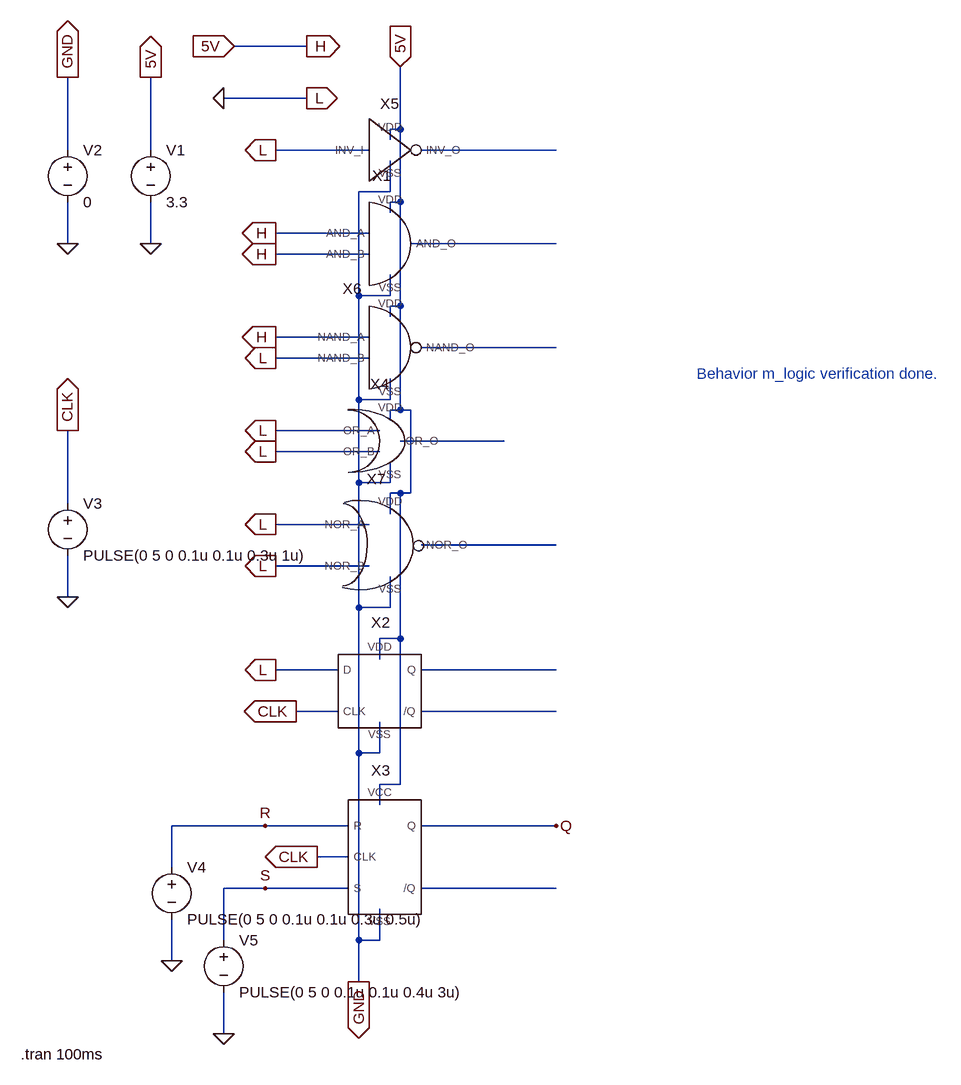
[diagram p0: schematic m_logic_test.asc]
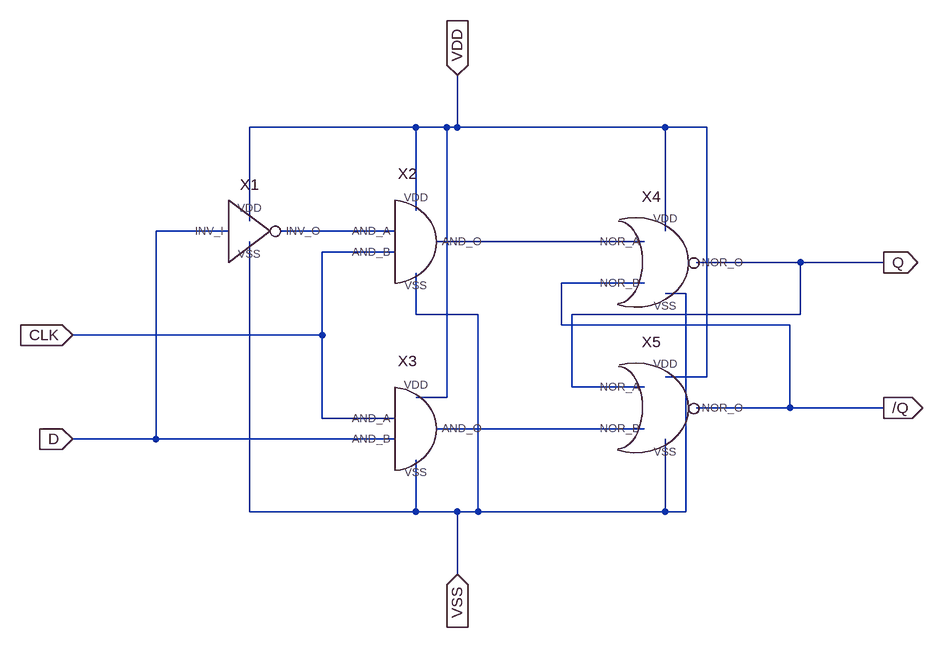
[diagram p1: sub-circuit m_dq_ff.asc]
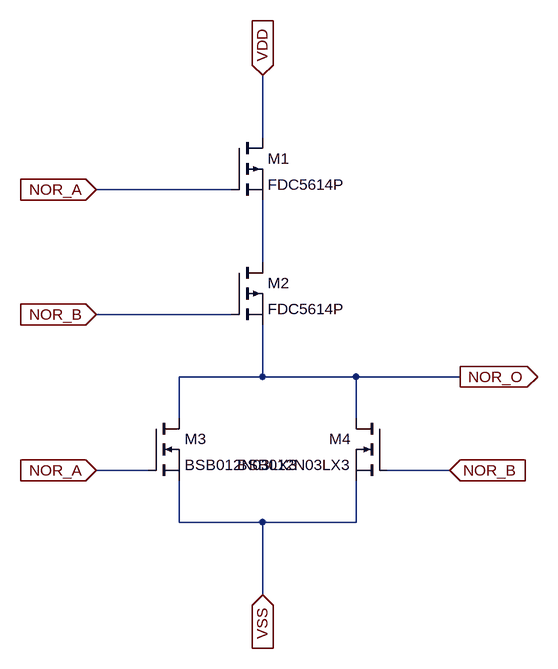
[diagram p2: sub-circuit m_nor.asc]
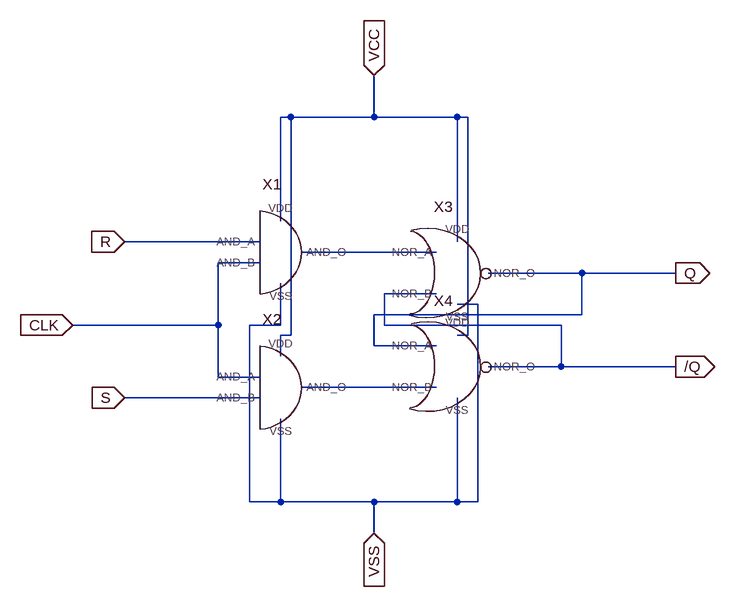
[diagram p3: sub-circuit m_sr_ff.asc]
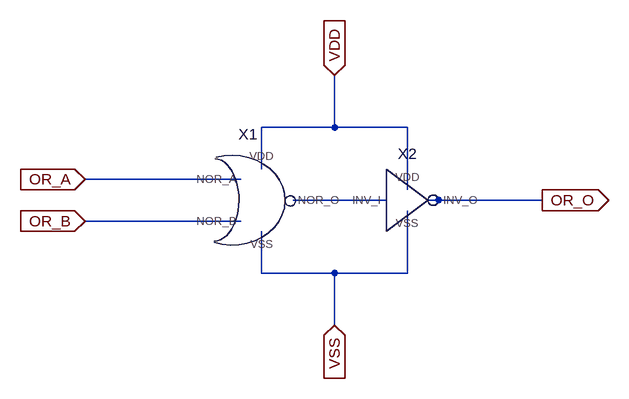
[diagram p4: sub-circuit m_or.asc]
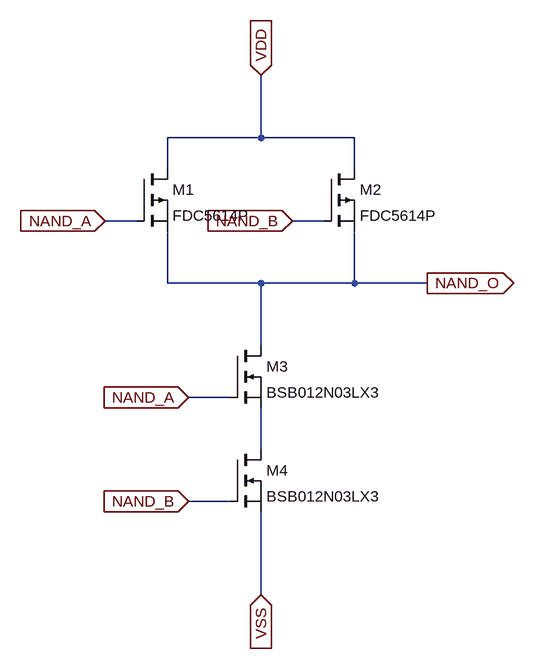
[diagram p5: sub-circuit m_nand.asc]
m_logic_test.asc, the LTspice schematic file:
Version 4
SHEET 1 1028 1140
WIRE 16 -432 -96 -432
WIRE 16 -352 -112 -352
WIRE 160 -304 160 -400
WIRE 160 -304 144 -304
WIRE 144 -288 144 -304
WIRE -352 -272 -352 -384
WIRE -224 -272 -224 -384
WIRE 112 -272 -32 -272
WIRE 400 -272 192 -272
WIRE 144 -208 144 -256
WIRE 144 -208 96 -208
WIRE 160 -192 160 -304
WIRE 160 -192 144 -192
WIRE 144 -176 144 -192
WIRE 112 -144 -32 -144
WIRE -352 -128 -352 -192
WIRE -224 -128 -224 -192
WIRE 400 -128 176 -128
WIRE 112 -112 -32 -112
WIRE 96 -48 96 -208
WIRE 144 -48 144 -80
WIRE 144 -48 96 -48
WIRE 160 -32 160 -192
WIRE 160 -32 144 -32
WIRE 144 -16 144 -32
WIRE 112 16 -32 16
WIRE 400 32 192 32
WIRE 112 48 -32 48
WIRE 96 112 96 -48
WIRE 144 112 144 80
WIRE 144 112 96 112
WIRE 160 128 160 -32
WIRE 160 128 144 128
WIRE 176 128 160 128
WIRE 144 144 144 128
WIRE 128 160 -32 160
WIRE 320 176 160 176
WIRE 128 192 -32 192
WIRE 96 240 96 112
WIRE 144 240 144 208
WIRE 144 240 96 240
WIRE 160 256 144 256
WIRE 176 256 176 128
WIRE 176 256 160 256
WIRE -352 272 -352 160
WIRE 144 288 144 256
WIRE 112 304 -32 304
WIRE 400 336 192 336
WIRE 112 368 -32 368
WIRE -352 416 -352 352
WIRE 96 432 96 240
WIRE 144 432 144 384
WIRE 144 432 96 432
WIRE 160 480 160 256
WIRE 160 480 128 480
WIRE 128 512 128 480
WIRE 64 528 -32 528
WIRE 400 528 192 528
WIRE 64 592 0 592
WIRE 400 592 192 592
WIRE 96 656 96 432
WIRE 128 656 128 608
WIRE 128 656 96 656
WIRE 160 704 160 480
WIRE 160 704 128 704
WIRE 128 736 128 704
WIRE -48 768 -192 768
WIRE 80 768 -48 768
WIRE 400 768 192 768
WIRE 80 816 32 816
WIRE -192 832 -192 768
WIRE -48 864 -112 864
WIRE 80 864 -48 864
WIRE 400 864 192 864
WIRE -112 944 -112 864
WIRE 96 944 96 656
WIRE 128 944 128 896
WIRE 128 944 96 944
WIRE -192 976 -192 912
WIRE 96 1008 96 944
WIRE -112 1088 -112 1024
FLAG -224 -128 0
FLAG -224 -384 5V
IOPIN -224 -384 Out
FLAG -352 -128 0
FLAG -352 -384 GND
IOPIN -352 -384 Out
FLAG -96 -432 5V
IOPIN -96 -432 In
FLAG 16 -432 H
IOPIN 16 -432 Out
FLAG -112 -352 0
FLAG 16 -352 L
IOPIN 16 -352 Out
FLAG -32 -272 L
IOPIN -32 -272 Out
FLAG 160 -400 5V
IOPIN 160 -400 In
FLAG 96 1008 GND
IOPIN 96 1008 Out
FLAG -32 -144 H
IOPIN -32 -144 Out
FLAG -32 -112 H
IOPIN -32 -112 Out
FLAG -32 16 H
IOPIN -32 16 Out
FLAG -32 48 L
IOPIN -32 48 Out
FLAG -32 160 L
IOPIN -32 160 Out
FLAG -32 192 L
IOPIN -32 192 Out
FLAG -32 304 L
IOPIN -32 304 Out
FLAG -32 368 L
IOPIN -32 368 Out
FLAG -32 528 L
IOPIN -32 528 Out
FLAG -352 416 0
FLAG -352 160 CLK
IOPIN -352 160 Out
FLAG 0 592 CLK
IOPIN 0 592 Out
FLAG 32 816 CLK
IOPIN 32 816 Out
FLAG -192 976 0
FLAG -112 1088 0
FLAG 400 768 Q
FLAG -48 768 R
FLAG -48 864 S
SYMBOL m_And 176 -128 R0
SYMATTR InstName X1
SYMBOL m_DQ_ff 112 560 R0
SYMATTR InstName X2
SYMBOL m_SR_ff 128 816 R0
SYMATTR InstName X3
SYMBOL m_Or 128 176 R0
SYMATTR InstName X4
SYMBOL m_Inverter 144 -272 R0
SYMATTR InstName X5
SYMBOL m_Nand 176 32 R0
SYMATTR InstName X6
SYMBOL m_Nor 192 336 R0
SYMATTR InstName X7
SYMBOL voltage -224 -288 R0
SYMATTR InstName V1
SYMATTR Value 3.3
SYMBOL voltage -352 -288 R0
SYMATTR InstName V2
SYMATTR Value 0
SYMBOL voltage -352 256 R0
WINDOW 123 0 0 Left 0
WINDOW 39 0 0 Left 0
SYMATTR InstName V3
SYMATTR Value PULSE(0 5 0 0.1u 0.1u 0.3u 1u)
SYMBOL voltage -192 816 R0
WINDOW 123 0 0 Left 0
WINDOW 39 0 0 Left 0
SYMATTR InstName V4
SYMATTR Value PULSE(0 5 0 0.1u 0.1u 0.3u 0.5u)
SYMBOL voltage -112 928 R0
WINDOW 123 0 0 Left 0
WINDOW 39 0 0 Left 0
SYMATTR InstName V5
SYMATTR Value PULSE(0 5 0 0.1u 0.1u 0.4u 3u)
TEXT -424 1120 Left 2 !.tran 100ms
TEXT 616 72 Left 2 ;Behavior m_logic verification done.

m_dq_ff.asc, the sub-circuit schematic file:
Version 4
SHEET 1 1180 748
WIRE 368 -48 112 -48
WIRE 416 -48 368 -48
WIRE 432 -48 432 -128
WIRE 432 -48 416 -48
WIRE 752 -48 432 -48
WIRE 816 -48 752 -48
WIRE 368 80 368 -48
WIRE 112 96 112 -48
WIRE 80 112 -32 112
WIRE 336 112 160 112
WIRE 752 112 752 -48
WIRE 720 128 400 128
WIRE 336 144 224 144
WIRE 960 160 800 160
WIRE 1088 160 960 160
WIRE 720 192 592 192
WIRE 784 208 752 208
WIRE 368 240 368 176
WIRE 464 240 368 240
WIRE 960 240 960 160
WIRE 960 240 608 240
WIRE 592 256 592 192
WIRE 944 256 592 256
WIRE 224 272 224 144
WIRE 224 272 -160 272
WIRE 816 336 816 -48
WIRE 816 336 752 336
WIRE 608 352 608 240
WIRE 720 352 608 352
WIRE 416 368 416 -48
WIRE 416 368 368 368
WIRE 944 384 944 256
WIRE 944 384 800 384
WIRE 1088 384 944 384
WIRE 224 400 224 272
WIRE 336 400 224 400
WIRE 720 416 400 416
WIRE -32 432 -32 112
WIRE -32 432 -160 432
WIRE 336 432 -32 432
WIRE 112 544 112 128
WIRE 368 544 368 464
WIRE 368 544 112 544
WIRE 432 544 368 544
WIRE 464 544 464 240
WIRE 464 544 432 544
WIRE 752 544 752 432
WIRE 752 544 464 544
WIRE 784 544 784 208
WIRE 784 544 752 544
WIRE 432 640 432 544
FLAG 432 -128 VDD
IOPIN 432 -128 In
FLAG 432 640 VSS
IOPIN 432 640 In
FLAG 1088 160 Q
IOPIN 1088 160 Out
FLAG 1088 384 /Q
IOPIN 1088 384 Out
FLAG -160 432 D
IOPIN -160 432 In
FLAG -160 272 CLK
IOPIN -160 272 In
SYMBOL m_Inverter 112 112 R0
SYMATTR InstName X1
SYMBOL m_And 400 128 R0
SYMATTR InstName X2
SYMBOL m_And 400 416 R0
SYMATTR InstName X3
SYMBOL m_Nor 800 160 R0
SYMATTR InstName X4
SYMBOL m_Nor 800 384 R0
SYMATTR InstName X5

m_nor.asc, the sub-circuit schematic file:
Version 4
SHEET 1 880 680
WIRE 144 -224 144 -320
WIRE 96 -144 -112 -144
WIRE 144 -32 144 -128
WIRE 96 48 -112 48
WIRE 144 144 144 64
WIRE 144 144 16 144
WIRE 288 144 144 144
WIRE 448 144 288 144
WIRE 16 208 16 144
WIRE 288 208 288 144
WIRE -32 288 -112 288
WIRE 432 288 336 288
WIRE 16 368 16 304
WIRE 144 368 16 368
WIRE 288 368 288 304
WIRE 288 368 144 368
WIRE 144 480 144 368
FLAG 144 480 VSS
IOPIN 144 480 In
FLAG 144 -320 VDD
IOPIN 144 -320 In
FLAG 448 144 NOR_O
IOPIN 448 144 Out
FLAG -112 288 NOR_A
IOPIN -112 288 In
FLAG -112 -144 NOR_A
IOPIN -112 -144 In
FLAG -112 48 NOR_B
IOPIN -112 48 In
FLAG 432 288 NOR_B
IOPIN 432 288 In
SYMBOL pmos 96 -224 R0
SYMATTR InstName M1
SYMATTR Value FDC5614P
SYMBOL pmos 96 -32 R0
SYMATTR InstName M2
SYMATTR Value FDC5614P
SYMBOL nmos -32 208 R0
SYMATTR InstName M3
SYMATTR Value BSB012N03LX3
SYMBOL nmos 336 208 M0
SYMATTR InstName M4
SYMATTR Value BSB012N03LX3

m_sr_ff.asc, the sub-circuit schematic file:
Version 4
SHEET 1 1004 680
WIRE 320 -96 304 -96
WIRE 448 -96 448 -160
WIRE 448 -96 320 -96
WIRE 576 -96 448 -96
WIRE 592 -96 576 -96
WIRE 304 64 304 -96
WIRE 272 96 64 96
WIRE 576 96 576 -96
WIRE 544 112 336 112
WIRE 272 128 208 128
WIRE 768 144 624 144
WIRE 912 144 768 144
WIRE 544 176 464 176
WIRE 608 192 576 192
WIRE 768 208 768 144
WIRE 768 208 448 208
WIRE 208 224 208 128
WIRE 208 224 -16 224
WIRE 304 224 304 160
WIRE 304 224 256 224
WIRE 464 224 464 176
WIRE 736 224 464 224
WIRE 320 240 320 -96
WIRE 320 240 304 240
WIRE 592 240 592 -96
WIRE 592 240 576 240
WIRE 448 256 448 208
WIRE 544 256 448 256
WIRE 304 272 304 240
WIRE 736 288 736 224
WIRE 736 288 624 288
WIRE 912 288 736 288
WIRE 208 304 208 224
WIRE 272 304 208 304
WIRE 544 320 336 320
WIRE 272 336 64 336
WIRE 256 496 256 224
WIRE 304 496 304 368
WIRE 304 496 256 496
WIRE 448 496 304 496
WIRE 576 496 576 336
WIRE 576 496 448 496
WIRE 608 496 608 192
WIRE 608 496 576 496
WIRE 448 544 448 496
FLAG -16 224 CLK
IOPIN -16 224 In
FLAG 912 144 Q
IOPIN 912 144 Out
FLAG 912 288 /Q
IOPIN 912 288 Out
FLAG 64 96 R
IOPIN 64 96 In
FLAG 64 336 S
IOPIN 64 336 In
FLAG 448 -160 VCC
IOPIN 448 -160 In
FLAG 448 544 VSS
IOPIN 448 544 In
SYMBOL m_And 336 112 R0
SYMATTR InstName X1
SYMBOL m_And 336 320 R0
SYMATTR InstName X2
SYMBOL m_Nor 624 144 R0
SYMATTR InstName X3
SYMBOL m_Nor 624 288 R0
SYMATTR InstName X4

m_or.asc, the sub-circuit schematic file:
Version 4
SHEET 1 880 680
WIRE 320 48 320 -32
WIRE 320 48 208 48
WIRE 432 48 320 48
WIRE 208 112 208 48
WIRE 176 128 -64 128
WIRE 432 144 432 48
WIRE 400 160 256 160
WIRE 640 160 464 160
WIRE 176 192 -64 192
WIRE 208 272 208 208
WIRE 320 272 208 272
WIRE 432 272 432 176
WIRE 432 272 320 272
WIRE 320 352 320 272
FLAG 640 160 OR_O
IOPIN 640 160 Out
FLAG -64 128 OR_A
IOPIN -64 128 In
FLAG -64 192 OR_B
IOPIN -64 192 In
FLAG 320 -32 VDD
IOPIN 320 -32 In
FLAG 320 352 VSS
IOPIN 320 352 In
SYMBOL m_Nor 256 160 R0
SYMATTR InstName X1
SYMBOL m_Inverter 432 160 R0
SYMATTR InstName X2

m_nand.asc, the sub-circuit schematic file:
Version 4
SHEET 1 880 680
WIRE 192 -336 192 -432
WIRE 192 -336 48 -336
WIRE 336 -336 192 -336
WIRE 48 -288 48 -336
WIRE 336 -288 336 -336
WIRE 0 -208 -48 -208
WIRE 288 -208 240 -208
WIRE 48 -112 48 -192
WIRE 192 -112 48 -112
WIRE 336 -112 336 -192
WIRE 336 -112 192 -112
WIRE 448 -112 336 -112
WIRE 192 -16 192 -112
WIRE 144 64 80 64
WIRE 192 144 192 80
WIRE 144 224 80 224
WIRE 192 368 192 240
FLAG 192 -432 VDD
IOPIN 192 -432 In
FLAG 192 368 VSS
IOPIN 192 368 In
FLAG -48 -208 NAND_A
IOPIN -48 -208 In
FLAG 448 -112 NAND_O
IOPIN 448 -112 Out
FLAG 240 -208 NAND_B
IOPIN 240 -208 In
FLAG 80 64 NAND_A
IOPIN 80 64 In
FLAG 80 224 NAND_B
IOPIN 80 224 In
SYMBOL pmos 0 -288 R0
SYMATTR InstName M1
SYMATTR Value FDC5614P
SYMBOL pmos 288 -288 R0
SYMATTR InstName M2
SYMATTR Value FDC5614P
SYMBOL nmos 144 -16 R0
SYMATTR InstName M3
SYMATTR Value BSB012N03LX3
SYMBOL nmos 144 144 R0
SYMATTR InstName M4
SYMATTR Value BSB012N03LX3

The netlist it stands for:
* m_logic_test.asc
XX1 H H H GND N002 m_And  ; pins AND_A AND_B VDD VSS AND_O
XX2 0 H GND N007 N006 CLK m_dq_ff
XX3 CLK R S H GND N008 Q m_sr_ff
XX4 0 0 H GND N004 m_or
XX5 0 H GND N001 m_Inverter  ; pins INV_I VDD VSS INV_O
XX6 H 0 H GND N003 m_nand
XX7 0 0 H GND N005 m_nor
V1 H 0 3.3
V2 GND 0 0
V3 CLK 0 PULSE(0 5 0 0.1u 0.1u 0.3u 1u)
V4 R 0 PULSE(0 5 0 0.1u 0.1u 0.3u 0.5u)
V5 S 0 PULSE(0 5 0 0.1u 0.1u 0.4u 3u)

* block symbol definitions
.subckt m_dq_ff D VDD VSS /Q Q CLK
XX1 D VDD VSS N001 m_Inverter  ; pins INV_I VDD VSS INV_O
XX2 N001 CLK VDD VSS N002 m_And  ; pins AND_A AND_B VDD VSS AND_O
XX3 CLK D VDD VSS N003 m_And  ; pins AND_A AND_B VDD VSS AND_O
XX4 N002 /Q VDD VSS Q m_nor
XX5 Q N003 VDD VSS /Q m_nor
.ends m_dq_ff

.subckt m_nor NOR_A NOR_B VDD VSS NOR_O
M1 VDD NOR_A N001 N001 FDC5614P
M2 N001 NOR_B NOR_O NOR_O FDC5614P
M3 NOR_O NOR_A VSS VSS BSB012N03LX3
M4 NOR_O NOR_B VSS VSS BSB012N03LX3
.ends m_nor

.subckt m_sr_ff CLK R S VCC VSS /Q Q
XX1 R CLK VCC VSS N001 m_And  ; pins AND_A AND_B VDD VSS AND_O
XX2 CLK S VCC VSS N002 m_And  ; pins AND_A AND_B VDD VSS AND_O
XX3 N001 /Q VCC VSS Q m_nor
XX4 Q N002 VCC VSS /Q m_nor
.ends m_sr_ff

.subckt m_or OR_A OR_B VDD VSS OR_O
XX1 OR_A OR_B VDD VSS N001 m_nor
XX2 N001 VDD VSS OR_O m_Inverter  ; pins INV_I VDD VSS INV_O
.ends m_or

.subckt m_nand NAND_A NAND_B VDD VSS NAND_O
M1 VDD NAND_A NAND_O NAND_O FDC5614P
M2 VDD NAND_B NAND_O NAND_O FDC5614P
M3 NAND_O NAND_A N001 N001 BSB012N03LX3
M4 N001 NAND_B VSS VSS BSB012N03LX3
.ends m_nand

.model NMOS NMOS
.model PMOS PMOS
.lib standard.mos
.tran 100ms
* Behavior m_logic verification done.
.backanno
.end